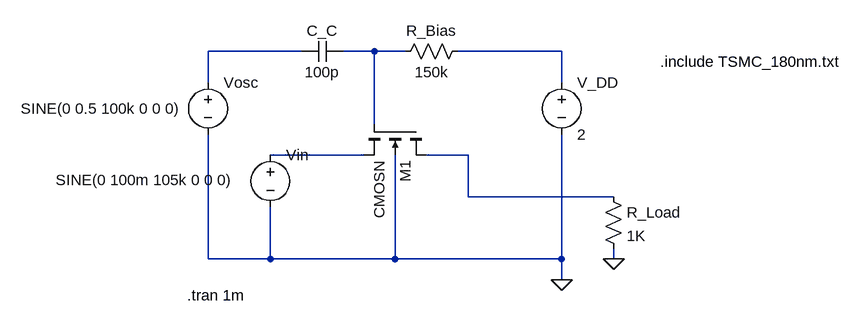
[diagram p0: schematic mixer.asc]
mixer.asc, the LTspice schematic file:
Version 4.1
SHEET 1 1404 680
WIRE 48 64 -96 64
WIRE 160 64 112 64
WIRE 208 64 160 64
WIRE 448 64 288 64
WIRE -96 112 -96 64
WIRE 448 112 448 64
WIRE 160 176 160 64
WIRE 144 224 0 224
WIRE 304 224 240 224
WIRE 304 288 304 224
WIRE 528 288 304 288
WIRE -96 384 -96 192
WIRE 0 384 0 304
WIRE 0 384 -96 384
WIRE 192 384 192 224
WIRE 192 384 0 384
WIRE 448 384 448 192
WIRE 448 384 192 384
WIRE 528 384 528 368
WIRE 448 416 448 384
FLAG 448 416 0
FLAG 528 384 0
SYMBOL res 192 80 R270
WINDOW 0 32 56 VTop 2
WINDOW 3 0 56 VBottom 2
SYMATTR InstName R_Bias
SYMATTR Value 150k
SYMBOL cap 112 48 R90
WINDOW 0 0 32 VBottom 2
WINDOW 3 32 32 VTop 2
SYMATTR InstName C_C
SYMATTR Value 100p
SYMBOL voltage 448 96 R0
WINDOW 123 0 0 Left 0
WINDOW 39 0 0 Left 0
SYMATTR InstName V_DD
SYMATTR Value 2
SYMBOL voltage -96 96 R0
WINDOW 123 0 0 Left 0
WINDOW 39 0 0 Left 0
WINDOW 3 -288 56 Left 2
SYMATTR Value SINE(0 0.5 100k 0 0 0)
SYMATTR InstName Vosc
SYMBOL res 512 272 R0
SYMATTR InstName R_Load
SYMATTR Value 1K
SYMBOL voltage 0 208 R0
WINDOW 123 0 0 Left 0
WINDOW 39 0 0 Left 0
WINDOW 3 -330 54 Left 2
SYMATTR Value SINE(0 100m 105k 0 0 0)
SYMATTR InstName Vin
SYMBOL nmos4 240 176 R90
SYMATTR InstName M1
SYMATTR Value CMOSN
SYMATTR Value2 l=0.18u w=2u  AD=0.36p AS=0.36p PD=4.36u PS=4.36u
TEXT 600 80 Left 2 !.include TSMC_180nm.txt
TEXT -128 440 Left 2 !.tran 1m

The netlist it stands for:
* mixer.asc
R_Bias N002 N003 150k
C_C N002 N001 100p
V_DD N003 0 2
Vosc N001 0 SINE(0 0.5 100k 0 0 0)
R_Load N005 0 1K
Vin N004 0 SINE(0 100m 105k 0 0 0)
M1 N005 N002 N004 0 CMOSN l=0.18u w=2u  AD=0.36p AS=0.36p PD=4.36u PS=4.36u
.model NMOS NMOS
.model PMOS PMOS
.lib standard.mos
.include TSMC_180nm.txt
.tran 1m
.backanno
.end